# Altium schematic sheet Trepanat_Sensors_2.SchDoc
size 840 x 594 mm; DocumentNumber: ПРО 2018.001 Э3; SheetNumber: 5; Format: A1
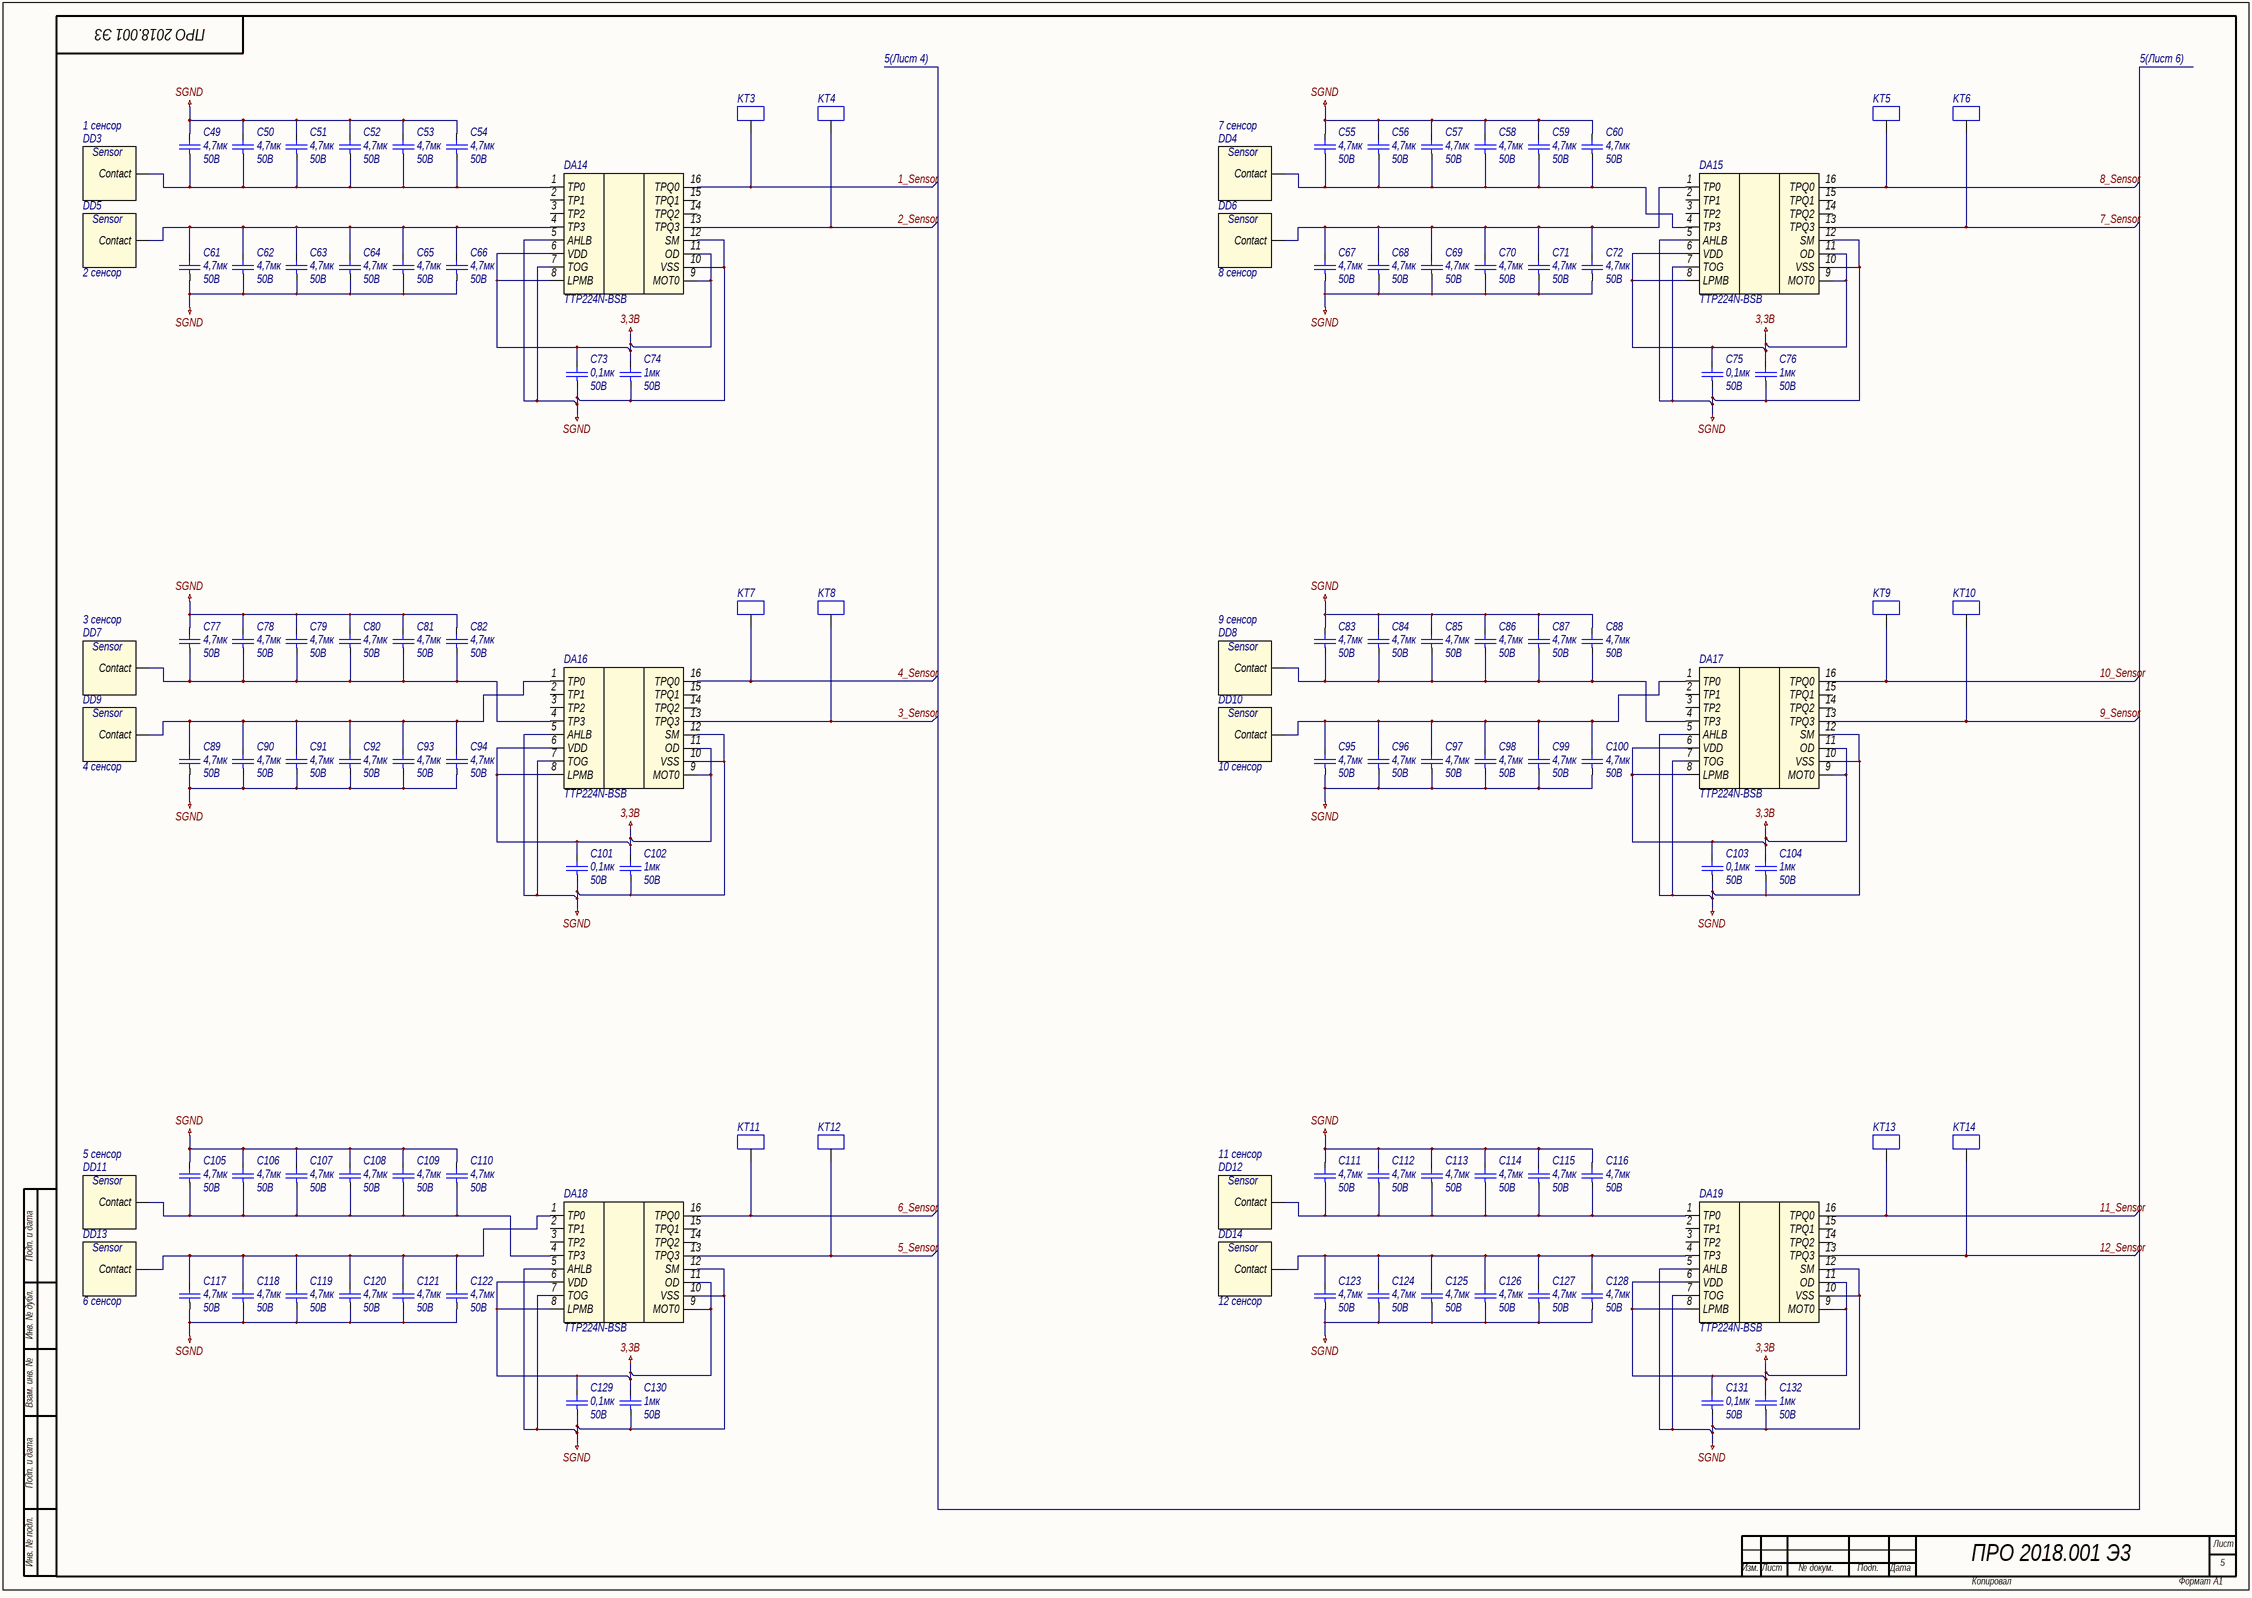
[diagram p0: Trepanat_Sensors_2.SchDoc]

## Parts
C49  4,7мк  Voltage: 50В  [C0805]
C50  4,7мк  Voltage: 50В  [C0805]
C51  4,7мк  Voltage: 50В  [C0805]
C52  4,7мк  Voltage: 50В  [C0805]
C53  4,7мк  Voltage: 50В  [C0805]
C54  4,7мк  Voltage: 50В  [C0805]
C55  4,7мк  Voltage: 50В  [C0805]
C56  4,7мк  Voltage: 50В  [C0805]
C57  4,7мк  Voltage: 50В  [C0805]
C58  4,7мк  Voltage: 50В  [C0805]
C59  4,7мк  Voltage: 50В  [C0805]
C60  4,7мк  Voltage: 50В  [C0805]
C61  4,7мк  Voltage: 50В  [C0805]
C62  4,7мк  Voltage: 50В  [C0805]
C63  4,7мк  Voltage: 50В  [C0805]
C64  4,7мк  Voltage: 50В  [C0805]
C65  4,7мк  Voltage: 50В  [C0805]
C66  4,7мк  Voltage: 50В  [C0805]
C67  4,7мк  Voltage: 50В  [C0805]
C68  4,7мк  Voltage: 50В  [C0805]
C69  4,7мк  Voltage: 50В  [C0805]
C70  4,7мк  Voltage: 50В  [C0805]
C71  4,7мк  Voltage: 50В  [C0805]
C72  4,7мк  Voltage: 50В  [C0805]
C73  0,1мк  Voltage: 50В  [C0805]
C74  1мк  Voltage: 50В  [C0805]
C75  0,1мк  Voltage: 50В  [C0805]
C76  1мк  Voltage: 50В  [C0805]
C77  4,7мк  Voltage: 50В  [C0805]
C78  4,7мк  Voltage: 50В  [C0805]
C79  4,7мк  Voltage: 50В  [C0805]
C80  4,7мк  Voltage: 50В  [C0805]
C81  4,7мк  Voltage: 50В  [C0805]
C82  4,7мк  Voltage: 50В  [C0805]
C83  4,7мк  Voltage: 50В  [C0805]
C84  4,7мк  Voltage: 50В  [C0805]
C85  4,7мк  Voltage: 50В  [C0805]
C86  4,7мк  Voltage: 50В  [C0805]
C87  4,7мк  Voltage: 50В  [C0805]
C88  4,7мк  Voltage: 50В  [C0805]
C89  4,7мк  Voltage: 50В  [C0805]
C90  4,7мк  Voltage: 50В  [C0805]
C91  4,7мк  Voltage: 50В  [C0805]
C92  4,7мк  Voltage: 50В  [C0805]
C93  4,7мк  Voltage: 50В  [C0805]
C94  4,7мк  Voltage: 50В  [C0805]
C95  4,7мк  Voltage: 50В  [C0805]
C96  4,7мк  Voltage: 50В  [C0805]
C97  4,7мк  Voltage: 50В  [C0805]
C98  4,7мк  Voltage: 50В  [C0805]
C99  4,7мк  Voltage: 50В  [C0805]
C100  4,7мк  Voltage: 50В  [C0805]
C101  0,1мк  Voltage: 50В  [C0805]
C102  1мк  Voltage: 50В  [C0805]
C103  0,1мк  Voltage: 50В  [C0805]
C104  1мк  Voltage: 50В  [C0805]
C105  4,7мк  Voltage: 50В  [C0805]
C106  4,7мк  Voltage: 50В  [C0805]
C107  4,7мк  Voltage: 50В  [C0805]
C108  4,7мк  Voltage: 50В  [C0805]
C109  4,7мк  Voltage: 50В  [C0805]
C110  4,7мк  Voltage: 50В  [C0805]
C111  4,7мк  Voltage: 50В  [C0805]
C112  4,7мк  Voltage: 50В  [C0805]
C113  4,7мк  Voltage: 50В  [C0805]
C114  4,7мк  Voltage: 50В  [C0805]
C115  4,7мк  Voltage: 50В  [C0805]
C116  4,7мк  Voltage: 50В  [C0805]
C117  4,7мк  Voltage: 50В  [C0805]
C118  4,7мк  Voltage: 50В  [C0805]
C119  4,7мк  Voltage: 50В  [C0805]
C120  4,7мк  Voltage: 50В  [C0805]
C121  4,7мк  Voltage: 50В  [C0805]
C122  4,7мк  Voltage: 50В  [C0805]
C123  4,7мк  Voltage: 50В  [C0805]
C124  4,7мк  Voltage: 50В  [C0805]
C125  4,7мк  Voltage: 50В  [C0805]
C126  4,7мк  Voltage: 50В  [C0805]
C127  4,7мк  Voltage: 50В  [C0805]
C128  4,7мк  Voltage: 50В  [C0805]
C129  0,1мк  Voltage: 50В  [C0805]
C130  1мк  Voltage: 50В  [C0805]
C131  0,1мк  Voltage: 50В  [C0805]
C132  1мк  Voltage: 50В  [C0805]
DA14  TTP224N-BSB  [SSOP16]
DA15  TTP224N-BSB  [SSOP16]
DA16  TTP224N-BSB  [SSOP16]
DA17  TTP224N-BSB  [SSOP16]
DA18  TTP224N-BSB  [SSOP16]
DA19  TTP224N-BSB  [SSOP16]
DD3  1 сенсор  [SENSOR]
DD4  7 сенсор  [SENSOR]
DD5  2 сенсор  [SENSOR]
DD6  8 сенсор  [SENSOR]
DD7  3 сенсор  [SENSOR]
DD8  9 сенсор  [SENSOR]
DD9  4 сенсор  [SENSOR]
DD10  10 сенсор  [SENSOR]
DD11  5 сенсор  [SENSOR]
DD12  11 сенсор  [SENSOR]
DD13  6 сенсор  [SENSOR]
DD14  12 сенсор  [SENSOR]
KT3  KT  [КТ]  (value not drawn)
KT4  KT  [КТ]  (value not drawn)
KT5  KT  [КТ]  (value not drawn)
KT6  KT  [КТ]  (value not drawn)
KT7  KT  [КТ]  (value not drawn)
KT8  KT  [КТ]  (value not drawn)
KT9  KT  [КТ]  (value not drawn)
KT10  KT  [КТ]  (value not drawn)
KT11  KT  [КТ]  (value not drawn)
KT12  KT  [КТ]  (value not drawn)
KT13  KT  [КТ]  (value not drawn)
KT14  KT  [КТ]  (value not drawn)

## Nets
3,3B: C73.2 C74.2 C75.2 C76.2 C101.2 C102.2 C103.2 C104.2 C129.2 C130.2 C131.2 C132.2 DA14.6(VDD) DA14.8(LPMB) DA14.9(MOT0) DA14.11(OD) DA15.6(VDD) DA15.8(LPMB) DA15.9(MOT0) DA15.11(OD) DA16.6(VDD) DA16.8(LPMB) DA16.9(MOT0) DA16.11(OD) DA17.6(VDD) DA17.8(LPMB) DA17.9(MOT0) DA17.11(OD) DA18.6(VDD) DA18.8(LPMB) DA18.9(MOT0) DA18.11(OD) DA19.6(VDD) DA19.8(LPMB) DA19.9(MOT0) DA19.11(OD)
SGND: C49.2 C50.2 C51.2 C52.2 C53.2 C54.2 C55.2 C56.2 C57.2 C58.2 C59.2 C60.2 C61.1 C62.1 C63.1 C64.1 C65.1 C66.1 C67.1 C68.1 C69.1 C70.1 C71.1 C72.1 C73.1 C74.1 C75.1 C76.1 C77.2 C78.2 C79.2 C80.2 C81.2 C82.2 C83.2 C84.2 C85.2 C86.2 C87.2 C88.2 C89.1 C90.1 C91.1 C92.1 C93.1 C94.1 C95.1 C96.1 C97.1 C98.1 C99.1 C100.1 C101.1 C102.1 C103.1 C104.1 C105.2 C106.2 C107.2 C108.2 C109.2 C110.2 C111.2 C112.2 C113.2 C114.2 C115.2 C116.2 C117.1 C118.1 C119.1 C120.1 C121.1 C122.1 C123.1 C124.1 C125.1 C126.1 C127.1 C128.1 C129.1 C130.1 C131.1 C132.1 DA14.5(AHLB) DA14.7(TOG) DA14.10(VSS) DA14.12(SM) DA15.5(AHLB) DA15.7(TOG) DA15.10(VSS) DA15.12(SM) DA16.5(AHLB) DA16.7(TOG) DA16.10(VSS) DA16.12(SM) DA17.5(AHLB) DA17.7(TOG) DA17.10(VSS) DA17.12(SM) DA18.5(AHLB) DA18.7(TOG) DA18.10(VSS) DA18.12(SM) DA19.5(AHLB) DA19.7(TOG) DA19.10(VSS) DA19.12(SM)
1_Sensor: DA14.16(TPQ0) KT3.1
2_Sensor: DA14.13(TPQ3) KT4.1
3_Sensor: DA16.13(TPQ3) KT8.1
4_Sensor: DA16.16(TPQ0) KT7.1
5_Sensor: DA18.13(TPQ3) KT12.1
6_Sensor: DA18.16(TPQ0) KT11.1
7_Sensor: DA15.13(TPQ3) KT6.1
8_Sensor: DA15.16(TPQ0) KT5.1
9_Sensor: DA17.13(TPQ3) KT10.1
10_Sensor: DA17.16(TPQ0) KT9.1
11_Sensor: DA19.16(TPQ0) KT13.1
12_Sensor: DA19.13(TPQ3) KT14.1
NetC49_1: C49.1 C50.1 C51.1 C52.1 C53.1 C54.1 DA14.1(TP0) DD3.1(Contact)
NetC55_1: C55.1 C56.1 C57.1 C58.1 C59.1 C60.1 DA15.4(TP3) DD4.1(Contact)
NetC61_2: C61.2 C62.2 C63.2 C64.2 C65.2 C66.2 DA14.4(TP3) DD5.1(Contact)
NetC67_2: C67.2 C68.2 C69.2 C70.2 C71.2 C72.2 DA15.1(TP0) DD6.1(Contact)
NetC77_1: C77.1 C78.1 C79.1 C80.1 C81.1 C82.1 DA16.4(TP3) DD7.1(Contact)
NetC83_1: C83.1 C84.1 C85.1 C86.1 C87.1 C88.1 DA17.4(TP3) DD8.1(Contact)
NetC89_2: C89.2 C90.2 C91.2 C92.2 C93.2 C94.2 DA16.1(TP0) DD9.1(Contact)
NetC95_2: C95.2 C96.2 C97.2 C98.2 C99.2 C100.2 DA17.1(TP0) DD10.1(Contact)
NetC105_1: C105.1 C106.1 C107.1 C108.1 C109.1 C110.1 DA18.4(TP3) DD11.1(Contact)
NetC111_1: C111.1 C112.1 C113.1 C114.1 C115.1 C116.1 DA19.1(TP0) DD12.1(Contact)
NetC117_2: C117.2 C118.2 C119.2 C120.2 C121.2 C122.2 DA18.1(TP0) DD13.1(Contact)
NetC123_2: C123.2 C124.2 C125.2 C126.2 C127.2 C128.2 DA19.4(TP3) DD14.1(Contact)

Not connected (* = marked no-connect by the designer): DA14 2(TP1) 3(TP2) 14(TPQ2) 15(TPQ1); DA15 2(TP1) 3(TP2) 14(TPQ2) 15(TPQ1); DA16 2(TP1) 3(TP2) 14(TPQ2) 15(TPQ1); DA17 2(TP1) 3(TP2) 14(TPQ2) 15(TPQ1); DA18 2(TP1) 3(TP2) 14(TPQ2) 15(TPQ1); DA19 2(TP1) 3(TP2) 14(TPQ2) 15(TPQ1)

## Notes on the sheet
- 5(Лист 4)
- 5(Лист 6)
- Подп. и дата
- Инв. № дубл.
- Взам. инв. №
- Инв. № подл.
- Лист
- Изм.
- № докум.
- Подп.
- Дата
- Копировал
- Формат

## Library data of the parts
C49-C132 = Capacitor: Конденсатор
  C49-C72 C77-C100 C105-C128: Value: 4,7мк
  C73 C75 C101 C103 C129 C131: Value: 0,1мк
  C74 C76 C102 C104 C130 C132: Value: 1мк
DA14-DA19 = TTP224N-BSB: 4 keys Touch Pad Detector IC; Name: TTP224N-BSB
DD3-DD14 = Sensor: Сенсорная площадка
  DD3: Name: 1 сенсор
  DD4: Name: 7 сенсор
  DD5: Name: 2 сенсор
  DD6: Name: 8 сенсор
  DD7: Name: 3 сенсор
  DD8: Name: 9 сенсор
  DD9: Name: 4 сенсор
  DD10: Name: 10 сенсор
  DD11: Name: 5 сенсор
  DD12: Name: 11 сенсор
  DD13: Name: 6 сенсор
  DD14: Name: 12 сенсор
KT3-KT14 = KT: Контрольная точка